# Altium schematic sheet buoys_sch.SchDoc
size A4
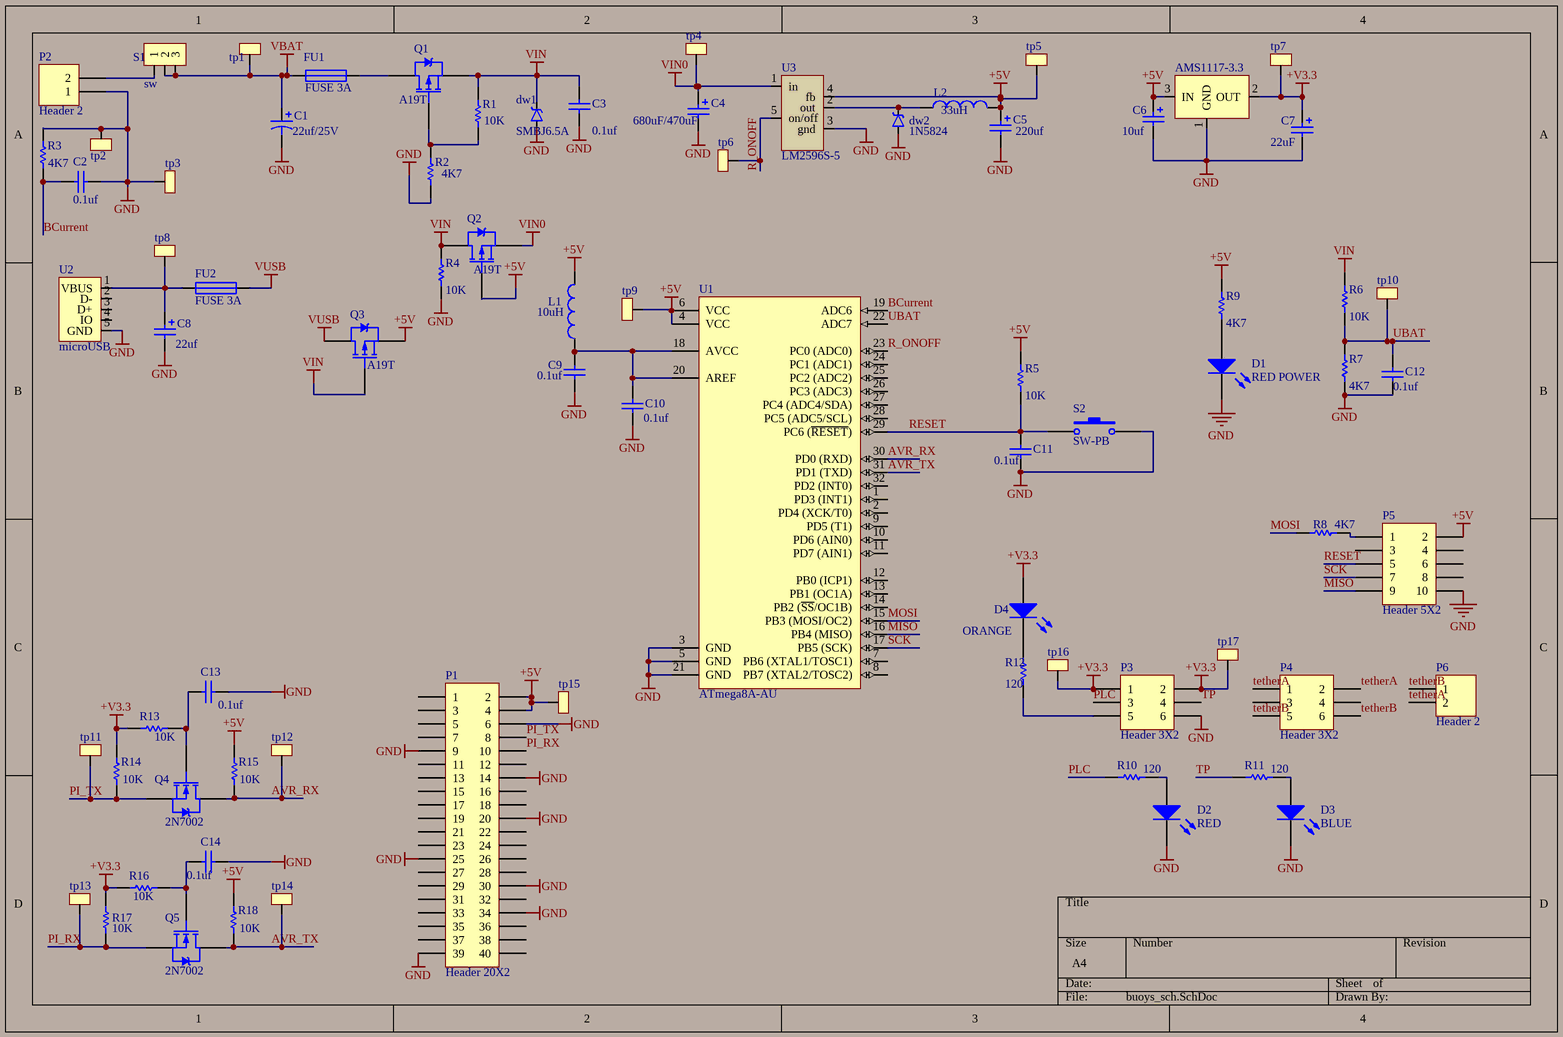
[diagram p0: buoys_sch.SchDoc]

## Parts
AMS1117-3.3  Component_3  [SOT223_M]  (value not drawn)
C1  value 22uf/25V  [5x5 C]  (hidden comment: Cap Pol1)
C2  value 0.1uf  [6-0805_M]  (hidden comment: Cap)
C3  value 0.1uf  [6-0805_M]  (hidden comment: Cap)
C4  value 680uF/470uF  [13x13 C]  (hidden comment: Cap Pol2)
C5  value 220uf  [8x8 C]  (hidden comment: Cap Pol2)
C6  value 10uf  [1206]  (hidden comment: Cap Pol2)
C7  value 22uF  [0603]  (hidden comment: Cap Pol2)
C8  value 22uf  [0603]  (hidden comment: Cap Pol2)
C9  value 0.1uf  [6-0805_M]  (hidden comment: Cap)
C10  value 0.1uf  [6-0805_M]  (hidden comment: Cap)
C11  value 0.1uf  [6-0805_M]  (hidden comment: Cap)
C12  value 0.1uf  [6-0805_M]  (hidden comment: Cap)
C13  value 0.1uf  [6-0805_M]  (hidden comment: Cap)
C14  value 0.1uf  [6-0805_M]  (hidden comment: Cap)
D1  RED POWER  [6-0805_M]
D2  RED  [6-0805_M]
D3  BLUE  [6-0805_M]
D4  ORANGE  [6-0805_M]
dw1  SMBJ6.5A  [SMBJ6.5A]
dw2  1N5824  [1N5824]
FU1  FUSE 3A  [1206]
FU2  FUSE 3A  [1206]
L1  value 10uH  [6-0805_M]  (hidden comment: Inductor)
L2  value 33uH  [12x12 L]  (hidden comment: Inductor)
P1  Header 20X2  [HDR2X20]
P2  Header 2  [HDR1X2]
P3  Header 3X2  [HDR2X3]
P4  Header 3X2  [HDR2X3]
P5  Header 5X2  [HDR2X5]
P6  Header 2  [tether]
Q1  A19T  [A19T]
Q2  A19T  [A19T]
Q3  A19T  [A19T]
Q4  2N7002  [2N7002]
Q5  2N7002  [2N7002]
R1  value 10K  [6-0805_M]  (hidden comment: Res1)
R2  value 4K7  [6-0805_M]  (hidden comment: Res1)
R3  value 4K7  [6-0805_M]  (hidden comment: Res1)
R4  value 10K  [6-0805_M]  (hidden comment: Res1)
R5  value 10K  [6-0805_M]  (hidden comment: Res1)
R6  value 10K  [6-0805_M]  (hidden comment: Res1)
R7  value 4K7  [6-0805_M]  (hidden comment: Res1)
R8  value 4K7  [6-0805_M]  (hidden comment: Res1)
R9  value 4K7  [6-0805_M]  (hidden comment: Res1)
R10  value 120  [6-0805_M]  (hidden comment: Res1)
R11  value 120  [6-0805_M]  (hidden comment: Res1)
R12  value 120  [6-0805_M]  (hidden comment: Res1)
R13  value 10K  [6-0805_M]  (hidden comment: Res1)
R14  value 10K  [6-0805_M]  (hidden comment: Res1)
R15  value 10K  [6-0805_M]  (hidden comment: Res1)
R16  value 10K  [6-0805_M]  (hidden comment: Res1)
R17  value 10K  [6-0805_M]  (hidden comment: Res1)
R18  value 10K  [6-0805_M]  (hidden comment: Res1)
S1  sw  [switch-2]
S2  SW-PB  [switch4]
tp1  testpoint  [tp]  (value not drawn)
tp2  testpoint  [tp]  (value not drawn)
tp3  testpoint  [tp]  (value not drawn)
tp4  testpoint  [tp]  (value not drawn)
tp5  testpoint  [tp]  (value not drawn)
tp6  testpoint  [tp]  (value not drawn)
tp7  testpoint  [tp]  (value not drawn)
tp8  testpoint  [tp]  (value not drawn)
tp9  testpoint  [tp]  (value not drawn)
tp10  testpoint  [tp]  (value not drawn)
tp11  testpoint  [tp]  (value not drawn)
tp12  testpoint  [tp]  (value not drawn)
tp13  testpoint  [tp]  (value not drawn)
tp14  testpoint  [tp]  (value not drawn)
tp15  testpoint  [tp]  (value not drawn)
tp16  testpoint  [tp]  (value not drawn)
tp17  testpoint  [tp]  (value not drawn)
U1  ATmega8A-AU  [32A_N]
U2  microUSB  [microUSB]
U3  LM2596S-5  [LM2596]

## Nets
+5V: AMS1117-3.3.3(IN) C5.1 C6.1 L1.2 L2.2 P1.2 P1.4 P5.2 Q2.1(G) Q3.3(S) R5.2 R9.2 R15.2 R18.2 tp5.1(TP) tp9.1(TP) tp15.1(TP) U1.4(VCC) U1.6(VCC) U3.4(fb)
+V3.3: AMS1117-3.3.2(OUT) C7.1 D4.1(A) P3.1 P3.2 R13.2 R14.2 R16.2 R17.2 tp7.1(TP) tp16.1(TP) tp17.1(TP)
GND: AMS1117-3.3.1(GND) C1.2 C2.2 C3.2 C4.2 C5.2 C6.2 C7.2 C8.2 C9.1 C10.2 C11.2 C12.1 C13.1 C14.1 D1.2(K) D2.2(K) D3.2(K) dw1.A dw2.A P1.6 P1.9 P1.14 P1.20 P1.25 P1.30 P1.34 P1.39 P2.1 P3.6 P5.10 R2.1 R3.2 R4.1 R7.1 S2.2 tp2.1(TP) tp3.1(TP) U1.3(GND) U1.5(GND) U1.21(GND) U2.5(GND) U3.3(gnd)
VBAT: C1.1 FU1.1 S1.2 S1.3 tp1.1(TP)
VIN: C3.1 dw1.K Q1.3(S) Q2.2(D) Q3.1(G) R1.1 R4.2 R6.2
VIN0: C4.1 Q2.3(S) tp4.1(TP) U3.1(in)
VUSB: FU2.2 Q3.2(D)
AVR_RX: Q4.2(D) R15.1 tp12.1(TP) U1.30(PD0_(RXD))
AVR_TX: Q5.2(D) R18.1 tp14.1(TP) U1.31(PD1_(TXD))
BCurrent: C2.1 R3.1 U1.19(ADC6)
MISO: P5.9 U1.16(PB4_(MISO))
MOSI: R8.2 U1.15(PB3_(MOSI/OC2))
PI_RX: P1.10 Q5.3(S) R17.1 tp13.1(TP)
PI_TX: P1.8 Q4.3(S) R14.1 tp11.1(TP)
PLC: P3.3 R10.2
R_ONOFF: tp6.1(TP) U1.23(PC0_(ADC0)) U3.5(on/off)
RESET: C11.1 P5.5 R5.1 S2.1 U1.29(PC6_(~{RESET}))
SCK: P5.7 U1.17(PB5_(SCK))
tetherA: P4.1 P4.2 P6.2
tetherB: P4.5 P4.6 P6.1
TP: P3.4 R11.2
UBAT: C12.2 R6.1 R7.2 tp10.1(TP) U1.22(ADC7)
NetC8_1: C8.1 FU2.1 tp8.1(TP) U2.1(VBUS)
NetC9_2: C9.2 C10.1 L1.1 U1.18(AVCC) U1.20(AREF)
NetC13_2: C13.2 Q4.1(G) R13.1
NetC14_2: C14.2 Q5.1(G) R16.1
NetD1_1: D1.1(A) R9.1
NetD2_1: D2.1(A) R10.1
NetD3_1: D3.1(A) R11.1
NetD4_2: D4.2(K) R12.1
Netdw2_K: dw2.K L2.1 U3.2(out)
NetFU1_2: FU1.2 Q1.2(D)
NetP2_2: P2.2 S1.1
NetP3_5: P3.5 R12.2
NetP5_1: P5.1 R8.1
NetQ1_1: Q1.1(G) R1.2 R2.2

Not connected (* = marked no-connect by the designer): P1 1 3 5 7 11 12 13 15 16 17 18 19 21 22 23 24 26 27 28 29 31 32 33 35 36 37 38 40; P4 3 4; P5 3 4 6 8; U1 1(PD3_(INT1)) 2(PD4_(XCK/T0)) 7(PB6_(XTAL1/TOSC1)) 8(PB7_(XTAL2/TOSC2)) 9(PD5_(T1)) 10(PD6_(AIN0)) 11(PD7_(AIN1)) 12(PB0_(ICP1)) 13(PB1_(OC1A)) 14(PB2_(~{SS}/OC1B)) 24(PC1_(ADC1)) 25(PC2_(ADC2)) 26(PC3_(ADC3)) 27(PC4_(ADC4/SDA)) 28(PC5_(ADC5/SCL)) 32(PD2_(INT0)); U2 2(D-) 3(D+) 4(IO)

## Library data of the parts
C1 = Cap Pol1: Polarized Capacitor (Radial); Published: 8-Jun-2000; LatestRevisionDate: 17-Jul-2002; LatestRevisionNote: Re-released for DXP Platform.; PackageReference: RB7.6-15; Publisher: Altium Limited; PackageDescription: Polarized Capacitor (Radial); 2 Leads
C2 C3 C9-C14 = Cap: Capacitor; Published: 8-Jun-2000; LatestRevisionDate: 17-Jul-2002; LatestRevisionNote: Re-released for DXP Platform.; PackageReference: RAD-0.3; Publisher: Altium Limited; PackageDescription: Radial Cap, Thru-Hole; 2 Leads; 0.3 in Pin Spacing
C4-C8 = Cap Pol2: Polarized Capacitor (Axial); Published: 8-Jun-2000; LatestRevisionDate: 17-Jul-2002; LatestRevisionNote: Re-released for DXP Platform.; PackageReference: POLAR0.8; Publisher: Altium Limited; PackageDescription: Polarized Capacitor; 2 Leads
D1-D4 = LED2: Typical RED, GREEN, YELLOW, AMBER GaAs LED; Published: 8-Jun-2000; LatestRevisionDate: 17-Jul-2002; LatestRevisionNote: Re-released for DXP Platform.; PackageVersion: Feb-2002; PackageReference: 3.2X1.6X1.1; Publisher: Altium Limited; PackageDescription: SM LED; 2 Flat Leads
dw1 dw2 = DW
FU1 FU2 = FUSE
L1 L2 = Inductor: Code_IEC: 1005; Published: 8-Jun-2000; LatestRevisionDate: 29-May-2009; LatestRevisionNote: IPC-7351 Footprint Added.; PackageReference: 0402-A; Publisher: Altium Limited; PackageDescription: Chip Inductor; Code_JEITA: 0402
P1 = Header 20X2: Header, 20-Pin, Dual row; LatestRevisionDate: 17-Jul-2002; LatestRevisionNote: Re-released for DXP Platform.; Publisher: Altium Limited
P2 P6 = Header 2: Header, 2-Pin; LatestRevisionDate: 17-Jul-2002; LatestRevisionNote: Re-released for DXP Platform.; Publisher: Altium Limited
P3 P4 = Header 3X2: Header, 3-Pin, Dual row; LatestRevisionDate: 17-Jul-2002; LatestRevisionNote: Re-released for DXP Platform.; Publisher: Altium Limited
P5 = Header 5X2: Header, 5-Pin, Dual row; LatestRevisionDate: 17-Jul-2002; LatestRevisionNote: Re-released for DXP Platform.; Publisher: Altium Limited
Q1-Q3 = PMOS-2: P-Channel Power MOSFET; Note: Pin 4 not drawn and electrically connected to Pin 2.; Published: 8-Jun-2000; LatestRevisionDate: 17-Jul-2002; LatestRevisionNote: Re-released for DXP Platform.; DatasheetVersion: PD-9.390D; PackageVersion: Feb-1997; PackageReference: TO-220AB; Publisher: Altium Limited; PackageDescription: TO, Thru-Hole, Vertical, Heatsink Mounted; 3 In-Line Leads; Pitch 2.54 mm; ComponentLink1Description: Manufacturer Link; ComponentLink1URL: http://www.irf.com/
Q4 Q5 = NMOS-2: N-Channel Power MOSFET; Note: Pin 2 is electrically connected to pin 4.; Published: 8-Jun-2000; LatestRevisionDate: 17-Jul-2002; LatestRevisionNote: Re-released for DXP Platform.; DatasheetVersion: PD-9.814; PackageVersion: Feb-1997; PackageReference: TO-220AB; Publisher: Altium Limited; PackageDescription: TO, Thru-Hole, Vertical, Heatsink Mounted; 3 In-Line Leads; Pitch 2.54 mm; ComponentLink1Description: Manufacturer Link; ComponentLink1URL: http://www.irf.com/
R1-R18 = Res1: Resistor; Published: 8-Jun-2000; LatestRevisionDate: 17-Jul-2002; LatestRevisionNote: Re-released for DXP Platform.; PackageReference: AXIAL-0.3; Publisher: Altium Limited; PackageDescription: Axial Device, Thru-Hole; 2 Leads; 0.3 in Pin Spacing
S2 = SW-PB: Switch; Published: 24-Mar-1999; LatestRevisionDate: 17-Jul-2002; LatestRevisionNote: Re-released for DXP Platform.; PackageReference: SPST-2; Publisher: Altium Limited; PackageDescription: Switch; 2 Leads
U1 = ATmega8A-AU: 8-bit AVR Microcontroller, 2.7-5.5V, 16MHz, 8KB Flash, 512 Bytes EEPROM, 1KB SRAM, 32-pin TQFP, Industrial Grade (-40癈 to 85癈); DatasheetVersion: revD, Feb-2011; PackageVersion: revC, Oct-2010; PackageReference: 32A; PackageDescription: 32-Lead, 7x7x1.0 mm Body, 0.8mm Lead Pitch, Thin Profile Plastic Quad Flat Package (TQFP); Code_JEDEC: MS-026-ABA; ComponentLink1Description: Manufacturer URL; ComponentLink1URL: http://www.atmel.com/; ComponentLink2Description: ATmega8A Datasheet; ComponentLink2URL: http://www.atmel.com/dyn/resources/prod_documents/doc8159.pdf; ComponentLink3Description: ATmega8A Summary; ComponentLink3URL: http://www.atmel.com/dyn/resources/prod_documents/8159S.pdf
U2 = Component_1
U3 = Component_2